# Altium project teensy_featherwing_pcb.PrjPCB
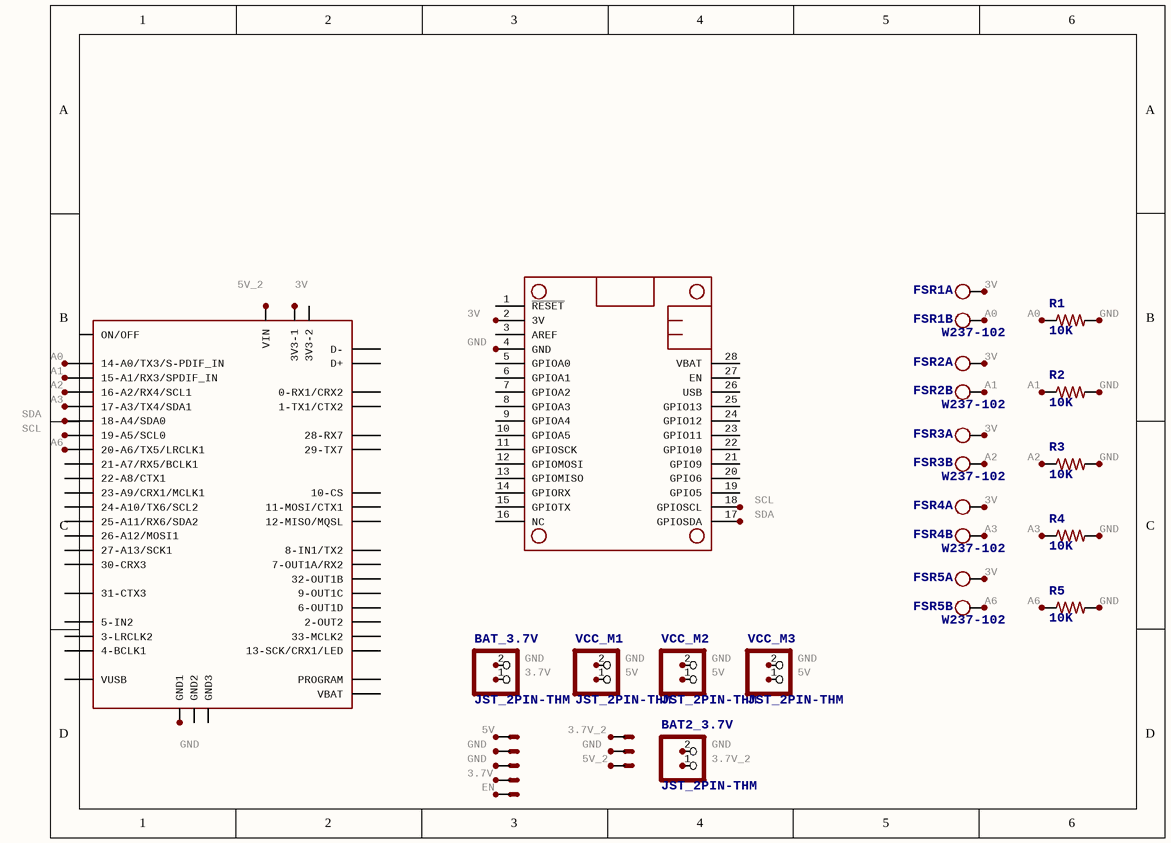
[diagram p0: teensy_featherwing_pcb.SchDoc]
1 sheet, 19 parts. Net scope: global (net labels, ports and power ports of the same name join across sheets).

## Sheet teensy_featherwing_pcb.SchDoc
size 197 x 147 mm

### Parts
5V_1A  22-23-2031  [22-23-2031]  (value not drawn)  (parts A,B,C of 3)
5V_3A  22-23-2051  [22-23-2051]  (value not drawn)  (parts A,B,C,D,E of 5)
BAT2_3.7V  JST_2PIN-THM  [JST-PH-2-THM]
BAT_3.7V  JST_2PIN-THM  [JST-PH-2-THM]
DC_MOTOR_DRIVER  FEATHERWING_NODIM  [FEATHERWING_DIM]  (value not drawn)
FSR1  W237-102  [W237-102]  (value not drawn)  (parts A,B of 2)
FSR2  W237-102  [W237-102]  (value not drawn)  (parts A,B of 2)
FSR3  W237-102  [W237-102]  (value not drawn)  (parts A,B of 2)
FSR4  W237-102  [W237-102]  (value not drawn)  (parts A,B of 2)
FSR5  W237-102  [W237-102]  (value not drawn)  (parts A,B of 2)
R1  10K  [0207/10]
R2  10K  [0207/10]
R3  10K  [0207/10]
R4  10K  [0207/10]
R5  10K  [0207/10]
U$1  TEENSY40  [TEENSY40]  (value not drawn)
VCC_M1  JST_2PIN-THM  [JST-PH-2-THM]
VCC_M2  JST_2PIN-THM  [JST-PH-2-THM]
VCC_M3  JST_2PIN-THM  [JST-PH-2-THM]

### Nets

Not connected (* = marked no-connect by the designer): 5V_1A 1(S) 2(S) 3(S); 5V_3A 1(S) 2(S) 3(S) 4(S) 5(S); BAT2_3.7V 1(2) 2(1); BAT_3.7V 1(2) 2(1); DC_MOTOR_DRIVER 1(~{RESET}) 2(3V) 3(AREF) 4(GND) 5(GPIOA0) 6(GPIOA1) 7(GPIOA2) 8(GPIOA3) 9(GPIOA4) 10(GPIOA5) 11(GPIOSCK) 12(GPIOMOSI) 13(GPIOMISO) 14(GPIORX) 15(GPIOTX) 16(NC) 17(GPIOSDA) 18(GPIOSCL) 19(GPIO5) 20(GPIO6) 21(GPIO9) 22(GPIO10) 23(GPIO11) 24(GPIO12) 25(GPIO13) 26(USB) 27(EN) 28(VBAT); FSR1 1(KL) 2(KL); FSR2 1(KL) 2(KL); FSR3 1(KL) 2(KL); FSR4 1(KL) 2(KL); FSR5 1(KL) 2(KL); R1 1 2; R2 1 2; R3 1 2; R4 1 2; R5 1 2; U$1 0-RX1(0-RX1/CRX2) 1-TX1(1-TX1/CTX2) 2-OUT2 3-LRCLK2 3V3-1 3V3-2 4-BCLK2(4-BCLK1) 5-IN2 6-OUT1D 7-RX2/OUT1A(7-OUT1A/RX2) 8-TX2/IN1(8-IN1/TX2) 9-OUT1C 10-CS/MQSR(10-CS) 11-MOSI/CTX1 12-MIO/MQSL(12-MISO/MQSL) 13-SCK/CRX1/LED 14-A0/TX3/S-PFI_OUT(14-A0/TX3/S-PDIF_IN) 15-A1/RX3/S-PDIF_IN(15-A1/RX3/SPDIF_IN) 16-A2/RX4/SCL1 17-A3/TX4/SDA1 18-A4/SDA0 19-A5/SCL0 20-A6/TX5/LRCLK1 21-A7/RX5/BCLK1 22-A8/CTX1 23-A9/CRX1/CCLK1(23-A9/CRX1/MCLK1) 24-A10/TX6/SCL2 25-A11/SDA2(25-A11/RX6/SDA2) 26-A12/MOSI1 27-A13/SCK1 28-RX7 29-TX7 30-CRX3 31-CTX3 32-OUTB1(32-OUT1B) 33-MCLK2 D+ D- GND1 GND2 GND3 ON/OFF PROGRAM VBAT VIN VUSB; VCC_M1 1(2) 2(1); VCC_M2 1(2) 2(1); VCC_M3 1(2) 2(1)

### Notes on the sheet
- (near U$1) 5V_2
- (near U$1) 3V
- (near FSR1) 3V
- (near U$1) A0
- (near DC_MOTOR_DRIVER) 3V
- (near DC_MOTOR_DRIVER) GND
- (near FSR2) 3V
- (near FSR1) A0
- (near R1) A0
- (near R1) GND
- (near U$1) SDA
- (near U$1) SCL
- (near U$1) A2
- (near U$1) A3
- (near U$1) A1
- (near FSR3) 3V
- (near FSR2) A1
- (near R2) A1
- (near R2) GND
- (near U$1) A6
- (near DC_MOTOR_DRIVER) SCL
- (near FSR4) 3V
- (near FSR3) A2
- (near R3) A2
- (near R3) GND
- (near DC_MOTOR_DRIVER) SDA
- (near FSR5) 3V
- (near FSR4) A3
- (near R4) A3
- (near R4) GND
- (near FSR5) A6
- (near R5) A6
- (near R5) GND
- (near BAT_3.7V) GND
- (near BAT_3.7V) 3.7V
- (near VCC_M1) GND
- (near VCC_M1) 5V
- (near VCC_M2) GND
- (near VCC_M2) 5V
- (near VCC_M3) GND
- (near VCC_M3) 5V
- (near U$1) GND
- (near 5V_3A) GND
- (near 5V_3A) 3.7V
- (near 5V_3A) 5V
- (near 5V_3A) EN
- (near 5V_1A) 3.7V_2
- (near 5V_1A) GND
- (near 5V_1A) 5V_2
- (near BAT2_3.7V) GND
- (near BAT2_3.7V) 3.7V_2

### Library data of the parts
5V_1A = 22-23-2031: .100" (2.54mm) Center Header - 3 Pin; MF: MOLEX; POPULARITY: 35; MPN: 22-23-2031; OC_FARNELL: 1462950; OC_NEWARK: 30C0862
5V_3A = 22-23-2051: .100" (2.54mm) Center Header - 5 Pin; MF: MOLEX; POPULARITY: 4; MPN: 22-23-2051; OC_FARNELL: 1462952; OC_NEWARK: 38C9178
BAT2_3.7V BAT_3.7V VCC_M1-VCC_M3 = JST_2PIN-THM: JST 2-Pin Connectors of various flavors SMT-RA (S2B-PH-SM4) 4UConnector #17311  SMT  (B2B-PH-SM4)  THM-RA (S2B-PH)  THM  (B2B-PH)
FSR1-FSR5 = W237-102: WAGO SCREW CLAMP; POPULARITY: 32; MPN: 237-102; OC_FARNELL: unknown; OC_NEWARK: 70K9898
R1-R5 = R-US_0207/10: RESISTOR, American symbol
U$1 = TEENSY40: Teensy 4.0 device including POGO pins for pins 24 - 33, but not yet pins for D+ and D-.  Symbol layout is what works for me and may not suite everyone... that can be added or additional symbols can be created to be used in a modilied davie name.